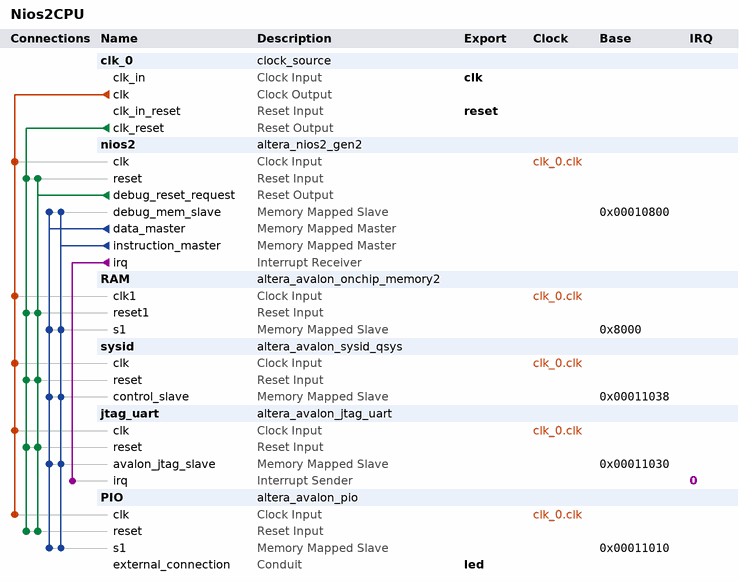
[diagram p0: system contents]
# Platform Designer (Qsys) system Nios2CPU, MAX 10 10M08SAE144C8GES
# Parameters at their usual value, and those the tool derives, are not listed.
package require -exact qsys 14.1
create_system Nios2CPU
set_project_property DEVICE_FAMILY {MAX 10}
set_project_property DEVICE 10M08SAE144C8GES

add_instance clk_0 clock_source 14.1
set_instance_parameter_value clk_0 clockFrequency 50000000

add_instance nios2 altera_nios2_gen2 14.1
set_instance_parameter_value nios2 dcache_size 2048
set_instance_parameter_value nios2 exceptionSlave RAM.s1
set_instance_parameter_value nios2 icache_size 4096
set_instance_parameter_value nios2 impl Tiny
set_instance_parameter_value nios2 resetSlave RAM.s1

add_instance RAM altera_avalon_onchip_memory2 14.1
set_instance_parameter_value RAM dataWidth 32
set_instance_parameter_value RAM dualPort false
set_instance_parameter_value RAM initMemContent true
set_instance_parameter_value RAM initializationFileName "E:\\MyProject\\My_project\\Altera\\Nios2CPU\\output_files\\software\\SafeCpt\\mem_init\\onchip_mem.hex"
set_instance_parameter_value RAM memorySize 32768
set_instance_parameter_value RAM useNonDefaultInitFile true

add_instance sysid altera_avalon_sysid_qsys 14.1
set_instance_parameter_value sysid id 0

add_instance jtag_uart altera_avalon_jtag_uart 14.1
set_instance_parameter_value jtag_uart simInteractiveOptions NO_INTERACTIVE_WINDOWS

add_instance PIO altera_avalon_pio 14.1
set_instance_parameter_value PIO direction Output
set_instance_parameter_value PIO width 4

# connections
add_connection clk_0.clk jtag_uart.clk clock
add_connection clk_0.clk nios2.clk clock
add_connection clk_0.clk PIO.clk clock
add_connection clk_0.clk RAM.clk1 clock
add_connection clk_0.clk sysid.clk clock
add_connection clk_0.clk_reset jtag_uart.reset reset
add_connection clk_0.clk_reset nios2.reset reset
add_connection clk_0.clk_reset PIO.reset reset
add_connection clk_0.clk_reset RAM.reset1 reset
add_connection clk_0.clk_reset sysid.reset reset
add_connection nios2.debug_reset_request jtag_uart.reset reset
add_connection nios2.debug_reset_request nios2.reset reset
add_connection nios2.debug_reset_request PIO.reset reset
add_connection nios2.debug_reset_request RAM.reset1 reset
add_connection nios2.debug_reset_request sysid.reset reset
add_connection nios2.data_master jtag_uart.avalon_jtag_slave avalon
set_connection_parameter_value nios2.data_master/jtag_uart.avalon_jtag_slave baseAddress 0x00011030
add_connection nios2.data_master nios2.debug_mem_slave avalon
set_connection_parameter_value nios2.data_master/nios2.debug_mem_slave baseAddress 0x00010800
add_connection nios2.data_master PIO.s1 avalon
set_connection_parameter_value nios2.data_master/PIO.s1 baseAddress 0x00011010
add_connection nios2.data_master RAM.s1 avalon
set_connection_parameter_value nios2.data_master/RAM.s1 baseAddress 0x8000
add_connection nios2.data_master sysid.control_slave avalon
set_connection_parameter_value nios2.data_master/sysid.control_slave baseAddress 0x00011038
add_connection nios2.instruction_master jtag_uart.avalon_jtag_slave avalon
set_connection_parameter_value nios2.instruction_master/jtag_uart.avalon_jtag_slave baseAddress 0x00011030
add_connection nios2.instruction_master nios2.debug_mem_slave avalon
set_connection_parameter_value nios2.instruction_master/nios2.debug_mem_slave baseAddress 0x00010800
add_connection nios2.instruction_master PIO.s1 avalon
set_connection_parameter_value nios2.instruction_master/PIO.s1 baseAddress 0x00011010
add_connection nios2.instruction_master RAM.s1 avalon
set_connection_parameter_value nios2.instruction_master/RAM.s1 baseAddress 0x8000
add_connection nios2.instruction_master sysid.control_slave avalon
set_connection_parameter_value nios2.instruction_master/sysid.control_slave baseAddress 0x00011038
add_connection nios2.irq jtag_uart.irq interrupt
set_connection_parameter_value nios2.irq/jtag_uart.irq irqNumber 0

# exported interfaces
add_interface clk clock sink
set_interface_property clk EXPORT_OF clk_0.clk_in
add_interface led conduit end
set_interface_property led EXPORT_OF PIO.external_connection
add_interface reset reset sink
set_interface_property reset EXPORT_OF clk_0.clk_in_reset

set_interconnect_requirement {$system} qsys_mm.clockCrossingAdapter HANDSHAKE
set_interconnect_requirement {$system} qsys_mm.insertDefaultSlave FALSE
set_interconnect_requirement {$system} qsys_mm.maxAdditionalLatency 1

save_system Nios2CPU.qsys
